# EasyEDA schematic SCH_relay-lite.json
TITLE: Sheet_1; REV: 1.0; Date: 2022-10-24; Sheet: 1/1; Drawn By: elanworld; Company: Your Company
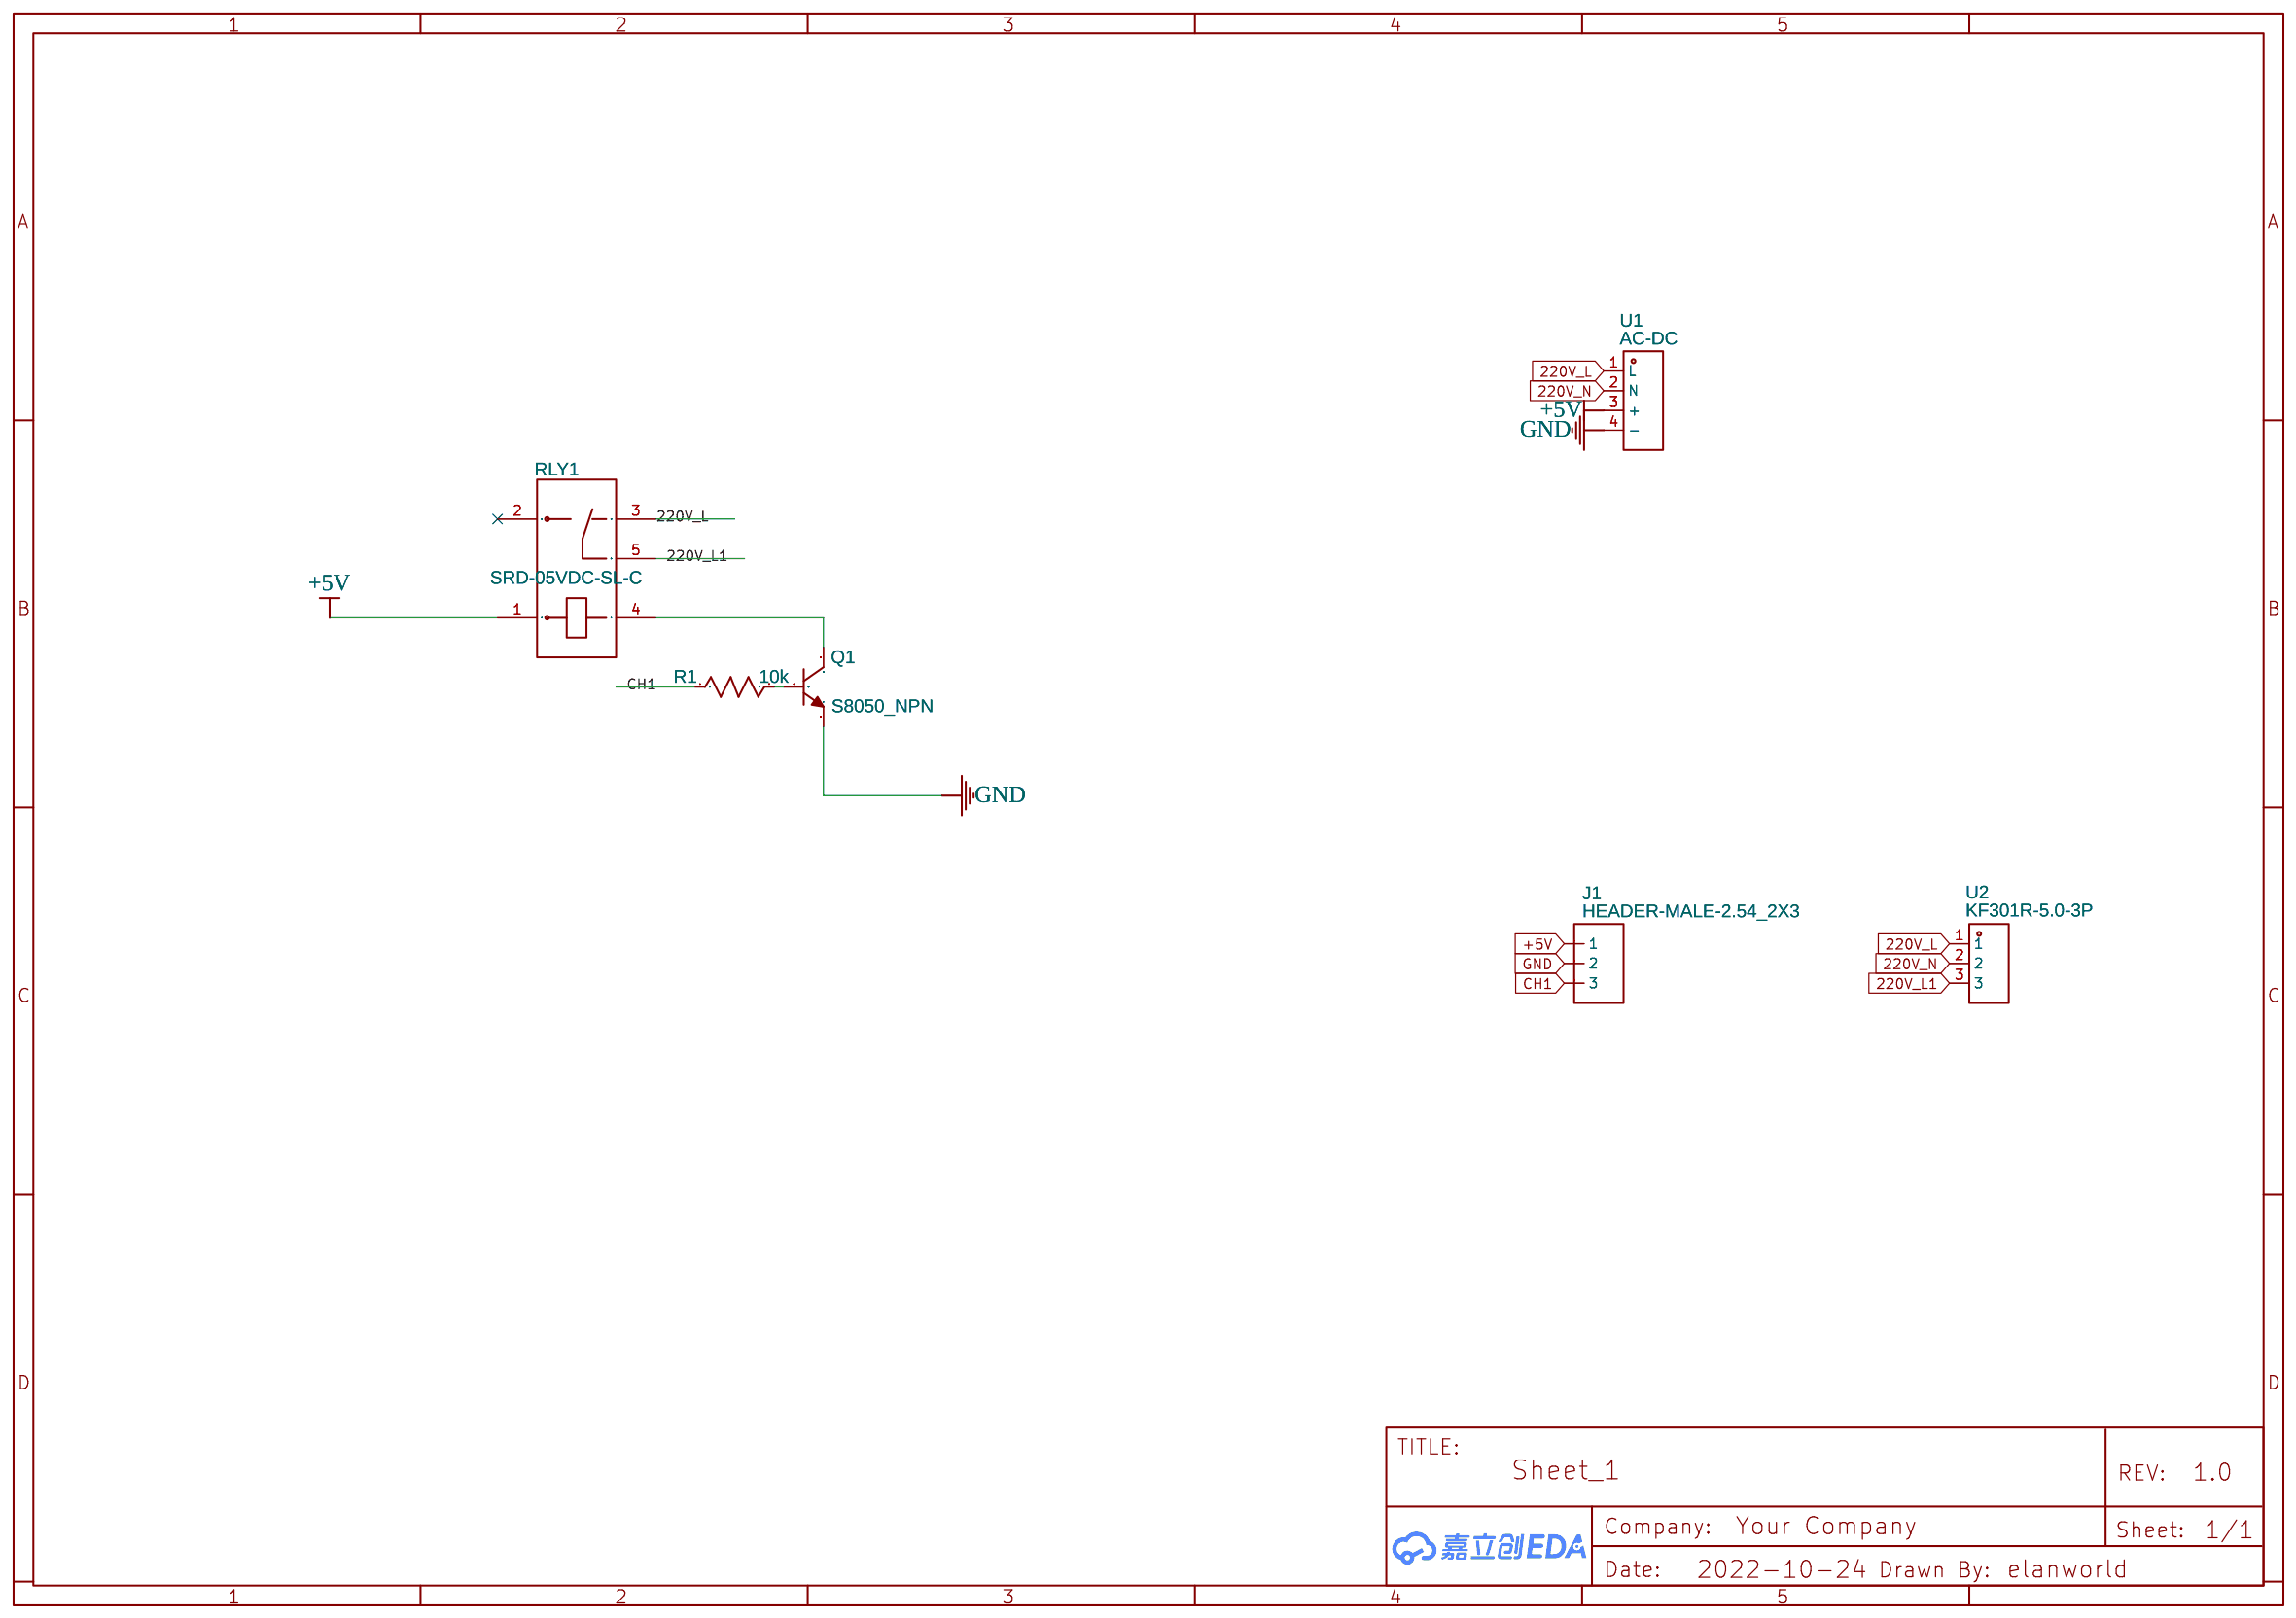
[diagram p0: schematic sheet]

## Parts
J1  HEADER-MALE-2.54_2X3  [SIP-2.54MM-3P-CJT-H2.54]
Q1  S8050_NPN  [SOT-23-3_L2.9-W1.3-P1.90-LS2.4-BR]
R1  10k  [R0603]
RLY1  SRD-05VDC-SL-C  [RELAY-TH_SRD-XXVDC-XL-C]
U1  AC-DC  [AC-DC]
U2  KF301R-5.0-3P  [CONN-TH_3P-P5.00]

## Library data of the parts
J1 = HEADER-MALE-2.54_2X3: Supplier: LCSC; Manufacturer: BOOMELE; Manufacturer Part: Header-Male-2.54_2x3; Supplier Part: C65114; Contributor: 5217zl
Q1 = S8050_C466625: Supplier: LCSC; Supplier Part: C466625; Manufacturer: High Diode; Manufacturer Part: S8050; Contributor: LCSC
R1 = R_0603_US: Contributor: LCEDA_Lib
RLY1 = SRD-05VDC-SL-C: Supplier: LCSC; Manufacturer: SONGLE; image: //image.lceda.cn/szlcsc/C35449.jpg; Supplier Part: C35449
U1 = AC-DC: Supplier: LCSC; Contributor: elanworld
U2 = KF301R-5.0-3P: Supplier: LCSC; Supplier Part: C474884; Manufacturer: Cixi Kefa Elec; Contributor: LCSC; JLCPCB Part Class: Extended Part

## Nets
220V_L: RLY1.3 U1.1(L) U2.1
220V_L1: RLY1.5 U2.3
220V_N: U1.2(N) U2.2
+5V: J1.1 RLY1.1 U1.3(+)
GND: J1.2 Q1.2(E) U1.4(-)
CH1: J1.3 R1.1
Net-(Q1-1): Q1.1(B) R1.2
Net-(Q1-3): Q1.3(C) RLY1.4

Not connected (* = marked no-connect by the designer): RLY1 2*
